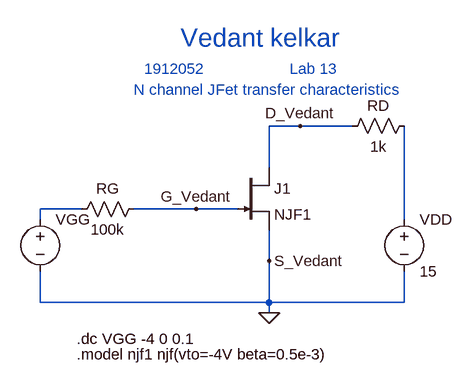
[diagram p0: schematic Draft20.asc]
Draft20.asc, the LTspice schematic file:
Version 4
SHEET 1 880 680
WIRE 288 0 240 0
WIRE 368 0 288 0
WIRE 240 64 240 0
WIRE -48 128 -112 128
WIRE 128 128 32 128
WIRE 192 128 128 128
WIRE -112 144 -112 128
WIRE 448 144 448 0
WIRE 240 208 240 160
WIRE -112 272 -112 224
WIRE 240 272 240 208
WIRE 240 272 -112 272
WIRE 448 272 448 224
WIRE 448 272 240 272
WIRE 240 288 240 272
FLAG 128 128 G_Vedant
FLAG 240 208 S_Vedant
FLAG 288 0 D_Vedant
FLAG 240 288 0
SYMBOL voltage -112 128 R0
WINDOW 123 0 0 Left 0
WINDOW 39 0 0 Left 0
SYMATTR InstName VGG
SYMATTR Value ""
SYMBOL voltage 448 128 R0
WINDOW 123 0 0 Left 0
WINDOW 39 0 0 Left 0
SYMATTR InstName VDD
SYMATTR Value 15
SYMBOL res 464 -16 R90
WINDOW 0 0 56 VBottom 2
WINDOW 3 32 56 VTop 2
SYMATTR InstName RD
SYMATTR Value 1k
SYMBOL njf 192 64 R0
SYMATTR InstName J1
SYMATTR Value NJF1
SYMBOL res 48 112 R90
WINDOW 0 0 56 VBottom 2
WINDOW 3 32 56 VTop 2
SYMATTR InstName RG
SYMATTR Value 100k
TEXT 104 -136 Left 4 ;Vedant kelkar
TEXT 48 -88 Left 2 ;1912052
TEXT 272 -88 Left 2 ;Lab 13
TEXT -56 328 Left 2 !.dc VGG -4 0 0.1
TEXT 32 -56 Left 2 ;N channel JFet transfer characteristics
TEXT -56 352 Left 2 !.model njf1 njf(vto=-4V beta=0.5e-3)

The netlist it stands for:
* Draft20.asc
VGG N001 0
VDD N002 0 15
RD N002 D_Vedant 1k
J1 D_Vedant G_Vedant 0 NJF1
RG G_Vedant N001 100k
.model NJF NJF
.model PJF PJF
.lib standard.jft
* Vedant kelkar
* 1912052
* Lab 13
.dc VGG -4 0 0.1
* N channel JFet transfer characteristics
.model njf1 njf(vto=-4V beta=0.5e-3)
.backanno
.end